# EAGLE schematic Temperature Junction (EAGLE 7.5.0)
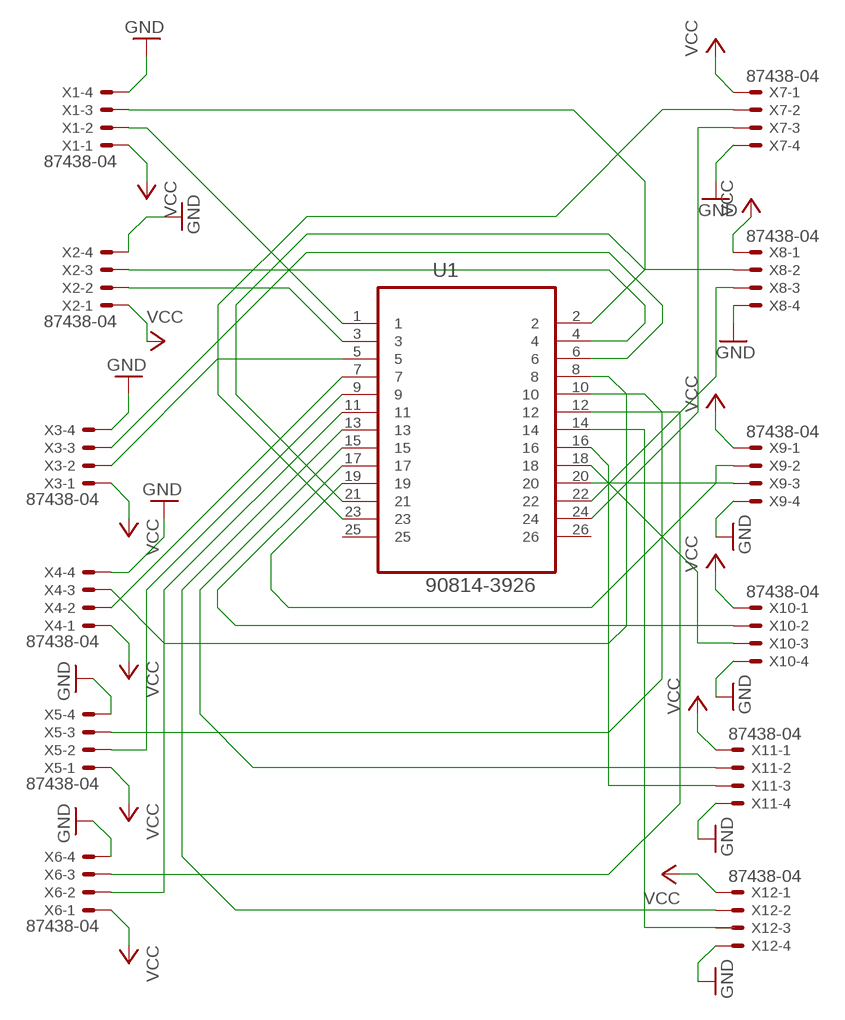
[diagram p0: schematic, sheet 1]

## Parts
U1  90814-3926  [MOLEX_90814-3926]
X1  87438-04  [87438-04]
X2  87438-04  [87438-04]
X3  87438-04  [87438-04]
X4  87438-04  [87438-04]
X5  87438-04  [87438-04]
X6  87438-04  [87438-04]
X7  87438-04  [87438-04]
X8  87438-04  [87438-04]
X9  87438-04  [87438-04]
X10  87438-04  [87438-04]
X11  87438-04  [87438-04]
X12  87438-04  [87438-04]

## Nets
GND: X1.4 X2.4 X3.4 X4.4 X5.4 X6.4 X7.4 X8.4 X9.4 X10.4 X11.4 X12.4
N$1: U1.1 X1.2
N$2: U1.2 X1.3
N$3: U1.3 X2.2
N$4: U1.4 X2.3
N$5: U1.6 X3.3
N$6: U1.5 X3.2
N$7: U1.8 X4.3
N$8: U1.10 X5.3
N$9: U1.12 X6.3
N$10: U1.14
N$11: U1.16 X11.3
N$12: U1.18 X10.3
N$13: U1.20 X9.3
N$14: U1.22 X8.3
N$15: U1.24 X7.3
N$16: U1.7 X4.2
N$17: U1.9 X5.2
N$18: U1.11 X6.2
N$19: U1.13 X12.2
N$20: U1.15 X11.2
N$21: U1.17 X10.2
N$22: U1.19 X9.2
N$23: U1.21 X8.2
N$24: U1.23 X7.2
VCC: X1.1 X2.1 X3.1 X4.1 X5.1 X6.1 X7.1 X8.1 X9.1 X10.1 X11.1 X12.1
Unconnected: U1.25 U1.26 X12.3

## Library data of the parts
U1 = Molex_By_element14_Batch_1:90814-3926: CONN HEADER 26POS 1.27MM SMD GOLD; MPN: 90814-3926; OC_FARNELL: 1757067; OC_NEWARK: 34R6253; PACKAGE: CONN-26POS; SUPPLIER: Molex
X1-X12 = con-molex:87438-04: Wire-to-Board 1.50mm (.059") Pitch Header - Right Angle, SMT, Shrouded Source: http://www.molex.com/product/micro/87438.html; OC_FARNELL: unknown; OC_NEWARK: unknown